# EAGLE schematic Schematic (EAGLE 9.6.2)
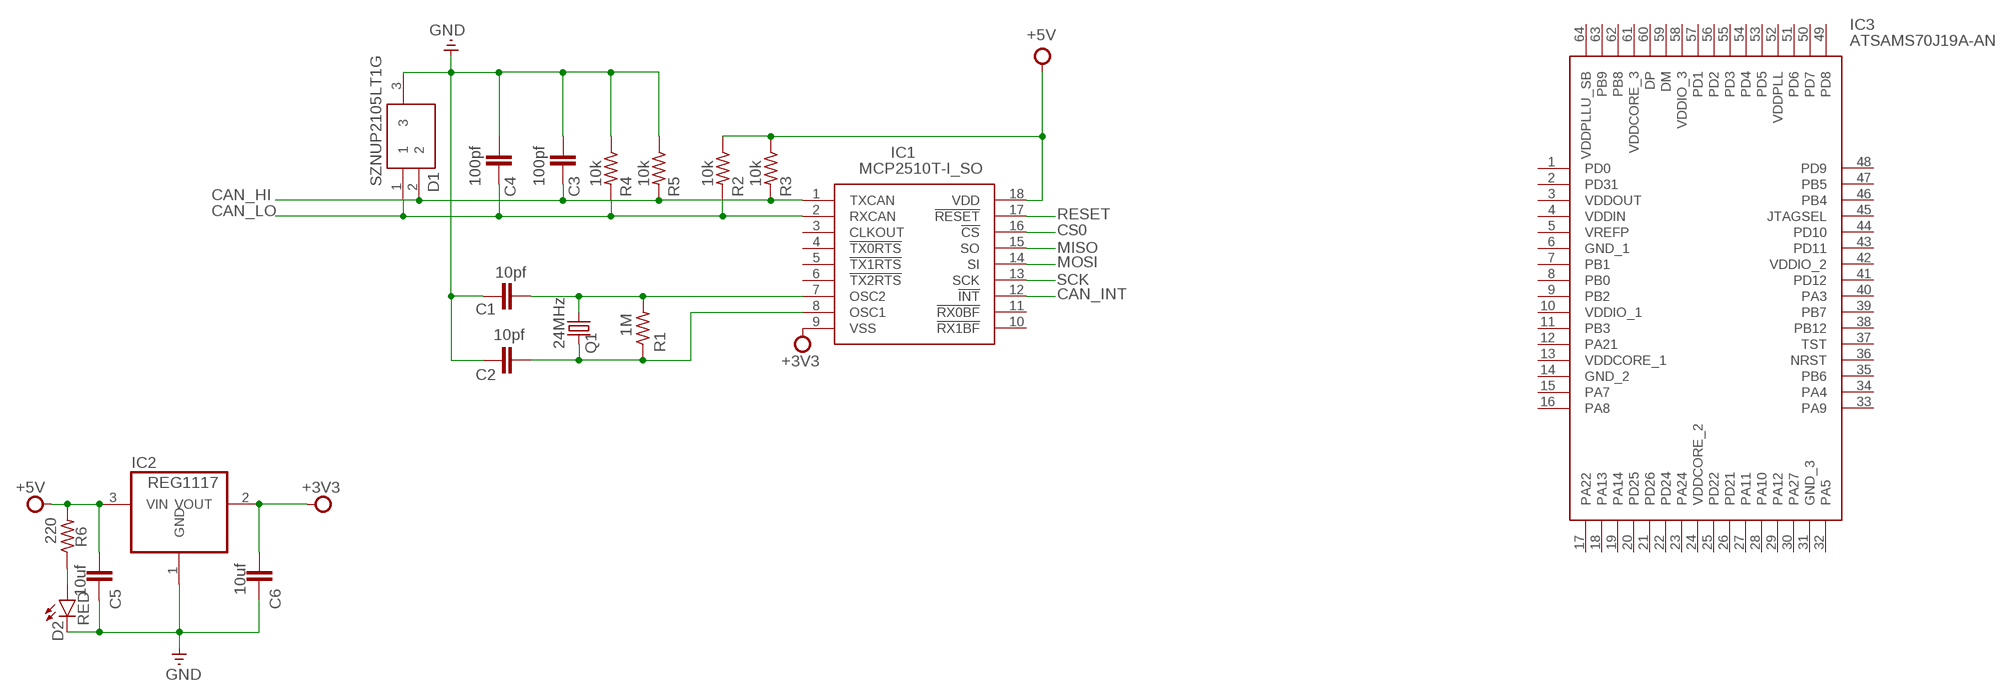
[diagram p0: schematic, sheet 1]

## Parts
C1  10pf  C2,5-3  [C2.5-3]
C2  10pf  C2,5-3  [C2.5-3]
C3  100pf  C2,5-3  [C2.5-3]
C4  100pf  C2,5-3  [C2.5-3]
C5  10uf  C2,5-3  [C2.5-3]
C6  10uf  C2,5-3  [C2.5-3]
D1  SZNUP2105LT1G  [SOT96P237X111-3N]
D2  RED  LED-RED_0402  [LED-0402]
IC1  MCP2510T-I_SO  [SOIC127P1030X265-18N]
IC2  REG1117  [SOT223]
IC3  ATSAMS70J19A-AN  [QFP50P1200X1200X160-64N]
Q1  24MHz  CRYSTALHC49S  [HC49/S]
R1  1M  R-US_0204/5  [0204/5]
R2  10k  R-US_0204/5  [0204/5]
R3  10k  R-US_0204/5  [0204/5]
R4  10k  R-US_0204/5  [0204/5]
R5  10k  R-US_0204/5  [0204/5]
R6  220  R-US_0204/5  [0204/5]

## Nets
+3V3: C6.1 IC1.9(VSS) IC2.2(VOUT)
+5V: C5.1 IC1.18(VDD) IC2.3(VIN) R2.1 R3.1 R6.2
CAN_HI: C3.1 D1.2 IC1.1(TXCAN) R3.2 R5.2
CAN_INT: IC1.12(!INT)
CAN_LO: C4.1 D1.1 IC1.2(RXCAN) R2.2 R4.2
CS0: IC1.16(!CS)
GND: C1.1 C2.1 C3.2 C4.2 C5.2 C6.2 D1.3 D2.C IC2.1(GND) R4.1 R5.1
MISO: IC1.15(SO)
MOSI: IC1.14(SI)
N$1: C1.2 IC1.7(OSC2) Q1.2 R1.2
N$2: C2.2 IC1.8(OSC1) Q1.1 R1.1
N$8: D2.A R6.1
RESET: IC1.17(!RESET)
SCK: IC1.13(SCK)
Unconnected: IC1.3(CLKOUT) IC1.4(!TX0RTS) IC1.5(!TX1RTS) IC1.6(!TX2RTS) IC1.10(!RX1BF) IC1.11(!RX0BF) IC3.1(PD0) IC3.2(PD31) IC3.3(VDDOUT) IC3.4(VDDIN) IC3.5(VREFP) IC3.6(GND_1) IC3.7(PB1) IC3.8(PB0) IC3.9(PB2) IC3.10(VDDIO_1) IC3.11(PB3) IC3.12(PA21) IC3.13(VDDCORE_1) IC3.14(GND_2) IC3.15(PA7) IC3.16(PA8) IC3.17(PA22) IC3.18(PA13) IC3.19(PA14) IC3.20(PD25) IC3.21(PD26) IC3.22(PD24) IC3.23(PA24) IC3.24(VDDCORE_2) IC3.25(PD22) IC3.26(PD21) IC3.27(PA11) IC3.28(PA10) IC3.29(PA12) IC3.30(PA27) IC3.31(GND_3) IC3.32(PA5) IC3.33(PA9) IC3.34(PA4) IC3.35(PB6) IC3.36(NRST) IC3.37(TST) IC3.38(PB12) IC3.39(PB7) IC3.40(PA3) IC3.41(PD12) IC3.42(VDDIO_2) IC3.43(PD11) IC3.44(PD10) IC3.45(JTAGSEL) IC3.46(PB4) IC3.47(PB5) IC3.48(PD9) IC3.49(PD8) IC3.50(PD7) IC3.51(PD6) IC3.52(VDDPLL) IC3.53(PD5) IC3.54(PD4) IC3.55(PD3) IC3.56(PD2) IC3.57(PD1) IC3.58(VDDIO_3) IC3.59(DM) IC3.60(DP) IC3.61(VDDCORE_3) IC3.62(PB8) IC3.63(PB9) IC3.64(VDDPLLU_SB)

## Library data of the parts
C1-C6 = capacitor-wima:C: CAPACITOR naming: grid - package width
D1 = SZNUP2105LT1G:SZNUP2105LT1G: Dual Bi-Directional TVS Diode, 350W peak, 3-pin SOT-23 Source: Datasheet <http://www.onsemi.com/pub/Collateral/NUP2105L-D.PDF>; DESCRIPTION: Dual Bi-Directional TVS Diode, 350W peak, 3-pin SOT-23; HEIGHT: 1.11mm; MANUFACTURER_NAME: onsemi; MANUFACTURER_PART_NUMBER: SZNUP2105LT1G; MOUSER_PART_NUMBER: 863-SZNUP2105LT1G; MOUSER_PRICE-STOCK: https://www.mouser.co.uk/ProductDetail/onsemi/SZNUP2105LT1G?qs=PJJcWtbOkNWqqZbXH80dfQ%3D%3D
D2 = SparkFun-LED:LED-RED: Red SMD LED Used in manufacturing of most products at SparkFun Packages: 0603 - SMD 0603 package [Product Link] <http://docs.avagotech.com/docs/AV02-0551EN> 0603 SMART - SMD 0603 SMART package ( more efficient and expensive)[Product Link] <http://www.osram-os.com/Graphics/XPic2/00077099_0.pdf> 1206 - SMD1206 package [Product Link] <https://www.sparkfun.com/datasheets/DevTools/LilyPad/Q150OVS4.pdff> SparkFun Products: Pro Mini 328 -5V <https://www.sparkfun.com/products/821> RedBoard <https://www.sparkfun.com/products/12757> IOIO-OTG <https://www.sparkfun.com/products/13613>; PROD_ID: DIO-16757
IC1 = MCP2510T-I_SO:MCP2510T-I_SO: IC, CAN Controller, stand alone, MCP2510T-I/SO Source: Datasheet <http://ww1.microchip.com/downloads/en/DeviceDoc/21291F.pdf>; DESCRIPTION: IC, CAN Controller, stand alone, MCP2510T-I/SO; HEIGHT: 2.65mm; MANUFACTURER_NAME: Microchip; MANUFACTURER_PART_NUMBER: MCP2510T-I/SO; MOUSER_PART_NUMBER: 579-MCP2510T-I/SO; MOUSER_PRICE-STOCK: https://www.mouser.co.uk/ProductDetail/Microchip-Technology-Atmel/MCP2510T-I-SO?qs=uMUszenkLLI5KRGT%252BhzzUQ%3D%3D
IC2 = burr-brown:REG1117: 800mA and 1A Low Dropout (LDO) Positive Regulator 1.8V, 2.5V, 2.85V, 3.3V, 5V, and Adj; MPN: REG1117; OC_FARNELL: 1097566; OC_NEWARK: 14P6981
IC3 = ATSAMS70J19A-AN:ATSAMS70J19A-AN: ARM Microcontrollers - MCU QFN,GREEN,EXT IND TEMP,MRL A - CM7,512kB Flash,256kB SRAM,LQFP64 Source: Datasheet <https://datasheet.datasheetarchive.com/originals/distributors/DKDS41/DSANUWW0026633.pdf>; DESCRIPTION: ARM Microcontrollers - MCU QFN,GREEN,EXT IND TEMP,MRL A - CM7,512kB Flash,256kB SRAM,LQFP64; HEIGHT: 1.6mm; MANUFACTURER_NAME: Microchip; MANUFACTURER_PART_NUMBER: ATSAMS70J19A-AN; MOUSER_PART_NUMBER: 556-ATSAMS70J19A-AN; MOUSER_PRICE-STOCK: https://www.mouser.co.uk/ProductDetail/Microchip-Technology/ATSAMS70J19A-AN?qs=nZCw0MZkbzZOW8jhoogCjA%3D%3D
Q1 = crystal:CRYSTAL: CRYSTAL; OC_FARNELL: 1667008; OC_NEWARK: unknown
R1-R6 = rcl:R-US_: RESISTOR, American symbol; SPICEPREFIX: R